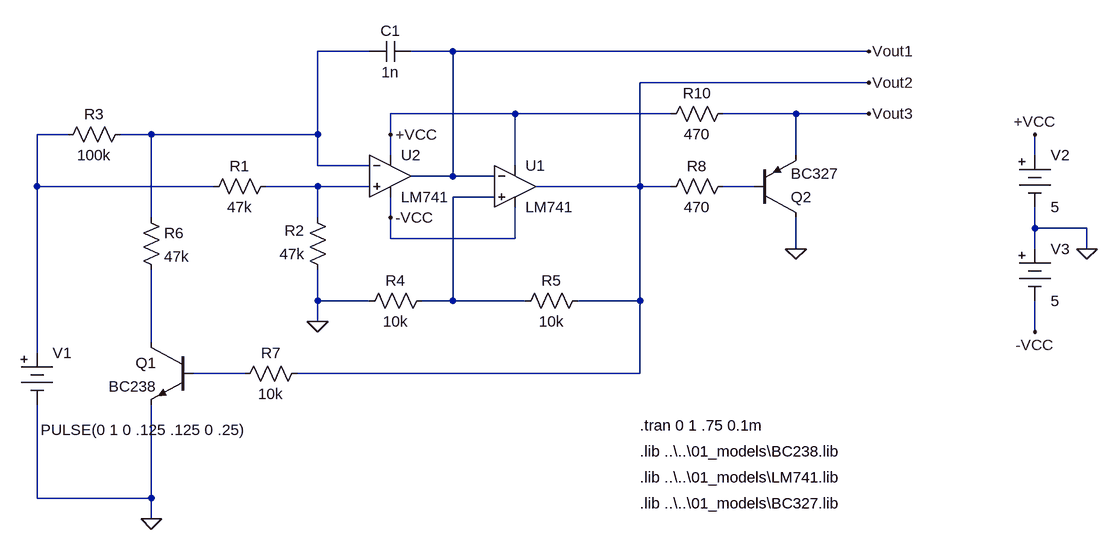
[diagram p0: schematic vco_04_05_03_adju_v1_tri_vout.asc]
vco_04_05_03_adju_v1_tri_vout.asc, the LTspice schematic file:
Version 4
SHEET 1 1844 680
WIRE 672 -272 592 -272
WIRE 800 -272 736 -272
WIRE 1440 -272 800 -272
WIRE 1440 -224 1088 -224
WIRE 896 -176 704 -176
WIRE 1136 -176 896 -176
WIRE 1328 -176 1216 -176
WIRE 1440 -176 1328 -176
WIRE 208 -144 160 -144
WIRE 336 -144 288 -144
WIRE 592 -144 592 -272
WIRE 592 -144 336 -144
WIRE 704 -144 704 -176
WIRE 704 -112 704 -144
WIRE 1328 -112 1328 -176
WIRE 1696 -112 1696 -144
WIRE 592 -96 592 -144
WIRE 672 -96 592 -96
WIRE 896 -96 896 -176
WIRE 800 -80 800 -272
WIRE 800 -80 736 -80
WIRE 864 -80 800 -80
WIRE 160 -64 160 -144
WIRE 432 -64 160 -64
WIRE 592 -64 512 -64
WIRE 672 -64 592 -64
WIRE 1088 -64 1088 -224
WIRE 1088 -64 928 -64
WIRE 1136 -64 1088 -64
WIRE 1264 -64 1216 -64
WIRE 864 -48 800 -48
WIRE 336 -16 336 -144
WIRE 592 -16 592 -64
WIRE 704 -16 704 -48
WIRE 1696 0 1696 -32
WIRE 1776 0 1696 0
WIRE 704 16 704 -16
WIRE 896 16 896 -32
WIRE 896 16 704 16
WIRE 1328 32 1328 -16
WIRE 1696 32 1696 0
WIRE 1776 32 1776 0
WIRE 592 112 592 64
WIRE 672 112 592 112
WIRE 800 112 800 -48
WIRE 800 112 752 112
WIRE 912 112 800 112
WIRE 1088 112 1088 -64
WIRE 1088 112 992 112
WIRE 592 144 592 112
WIRE 1696 160 1696 112
WIRE 336 176 336 64
WIRE 160 192 160 -64
WIRE 480 224 400 224
WIRE 1088 224 1088 112
WIRE 1088 224 560 224
WIRE 160 416 160 272
WIRE 336 416 336 272
WIRE 336 416 160 416
WIRE 336 448 336 416
FLAG 336 448 0
FLAG 592 144 0
FLAG 1328 32 0
FLAG 1440 -272 Vout1
FLAG 1440 -224 Vout2
FLAG 1440 -176 Vout3
FLAG 1776 32 0
FLAG 1696 -144 +VCC
FLAG 1696 160 -VCC
FLAG 704 -144 +VCC
FLAG 704 -16 -VCC
SYMBOL Misc\\battery 160 176 R0
WINDOW 123 0 0 Left 2
WINDOW 39 0 0 Left 2
WINDOW 3 6 135 Left 2
SYMATTR InstName V1
SYMATTR Value PULSE(0 1 0 .125 .125 0 .25)
SYMBOL res 304 -160 R90
WINDOW 0 0 56 VBottom 2
WINDOW 3 32 56 VTop 2
SYMATTR InstName R3
SYMATTR Value 100k
SYMBOL res 320 -32 R0
SYMATTR InstName R6
SYMATTR Value 47k
SYMBOL npn 400 176 M0
SYMATTR InstName Q1
SYMATTR Value BC238
SYMBOL res 528 -80 R90
WINDOW 0 0 56 VBottom 2
WINDOW 3 32 56 VTop 2
SYMATTR InstName R1
SYMATTR Value 47k
SYMBOL res 608 80 R180
WINDOW 0 36 76 Left 2
WINDOW 3 36 40 Left 2
SYMATTR InstName R2
SYMATTR Value 47k
SYMBOL Opamps\\opamp2 704 -144 R0
SYMATTR InstName U2
SYMATTR Value LM741
SYMBOL res 768 96 R90
WINDOW 0 0 56 VBottom 2
WINDOW 3 32 56 VTop 2
SYMATTR InstName R4
SYMATTR Value 10k
SYMBOL res 1008 96 R90
WINDOW 0 0 56 VBottom 2
WINDOW 3 32 56 VTop 2
SYMATTR InstName R5
SYMATTR Value 10k
SYMBOL Opamps\\opamp2 896 -128 R0
SYMATTR InstName U1
SYMATTR Value LM741
SYMBOL cap 736 -288 R90
WINDOW 0 0 32 VBottom 2
WINDOW 3 32 32 VTop 2
SYMATTR InstName C1
SYMATTR Value 1n
SYMBOL res 576 208 R90
WINDOW 0 0 56 VBottom 2
WINDOW 3 32 56 VTop 2
SYMATTR InstName R7
SYMATTR Value 10k
SYMBOL res 1232 -80 R90
WINDOW 0 0 56 VBottom 2
WINDOW 3 32 56 VTop 2
SYMATTR InstName R8
SYMATTR Value 470
SYMBOL pnp 1264 -16 M180
SYMATTR InstName Q2
SYMATTR Value BC327
SYMBOL res 1232 -192 R90
WINDOW 0 0 56 VBottom 2
WINDOW 3 32 56 VTop 2
SYMATTR InstName R10
SYMATTR Value 470
SYMBOL Misc\\battery 1696 -128 R0
WINDOW 123 0 0 Left 2
WINDOW 39 0 0 Left 2
SYMATTR InstName V2
SYMATTR Value 5
SYMBOL Misc\\battery 1696 16 R0
WINDOW 123 0 0 Left 2
WINDOW 39 0 0 Left 2
SYMATTR InstName V3
SYMATTR Value 5
TEXT 1088 344 Left 2 !.lib ..\\..\\01_models\\BC238.lib
TEXT 1088 384 Left 2 !.lib ..\\..\\01_models\\LM741.lib
TEXT 1088 424 Left 2 !.lib ..\\..\\01_models\\BC327.lib
TEXT 1088 304 Left 2 !.tran 0 1 .75 0.1m

The netlist it stands for:
* vco_04_05_03_adju_v1_tri_vout.asc
V1 N002 0 PULSE(0 1 0 .125 .125 0 .25)
R3 N001 N002 100k
R6 N001 N006 47k
Q1 N006 N007 0 0 BC238
R1 N003 N002 47k
R2 0 N003 47k
XU2 N003 N001 +VCC -VCC Vout1 LM741  ; pins In+ In- V+ V- OUT
R4 N005 0 10k
R5 Vout2 N005 10k
XU1 N005 Vout1 +VCC -VCC Vout2 LM741  ; pins In+ In- V+ V- OUT
C1 Vout1 N001 1n
R7 Vout2 N007 10k
R8 N004 Vout2 470
Q2 0 N004 Vout3 0 BC327
R10 Vout3 +VCC 470
V2 +VCC 0 5
V3 0 -VCC 5
.model NPN NPN
.model PNP PNP
.lib standard.bjt
.lib ..\..\01_models\BC238.lib
.lib ..\..\01_models\LM741.lib
.lib ..\..\01_models\BC327.lib
.tran 0 1 .75 0.1m
.backanno
.end